# Altium project fastic_readout.PrjPcb (part 2 of 3)

## Sheet hv.SchDoc: FastIC+ readout
size 297 x 209 mm; Organization: CERN; SheetNumber: 5; SheetTotal: 6; Projet: Fast Timing; ModifiedDate: -
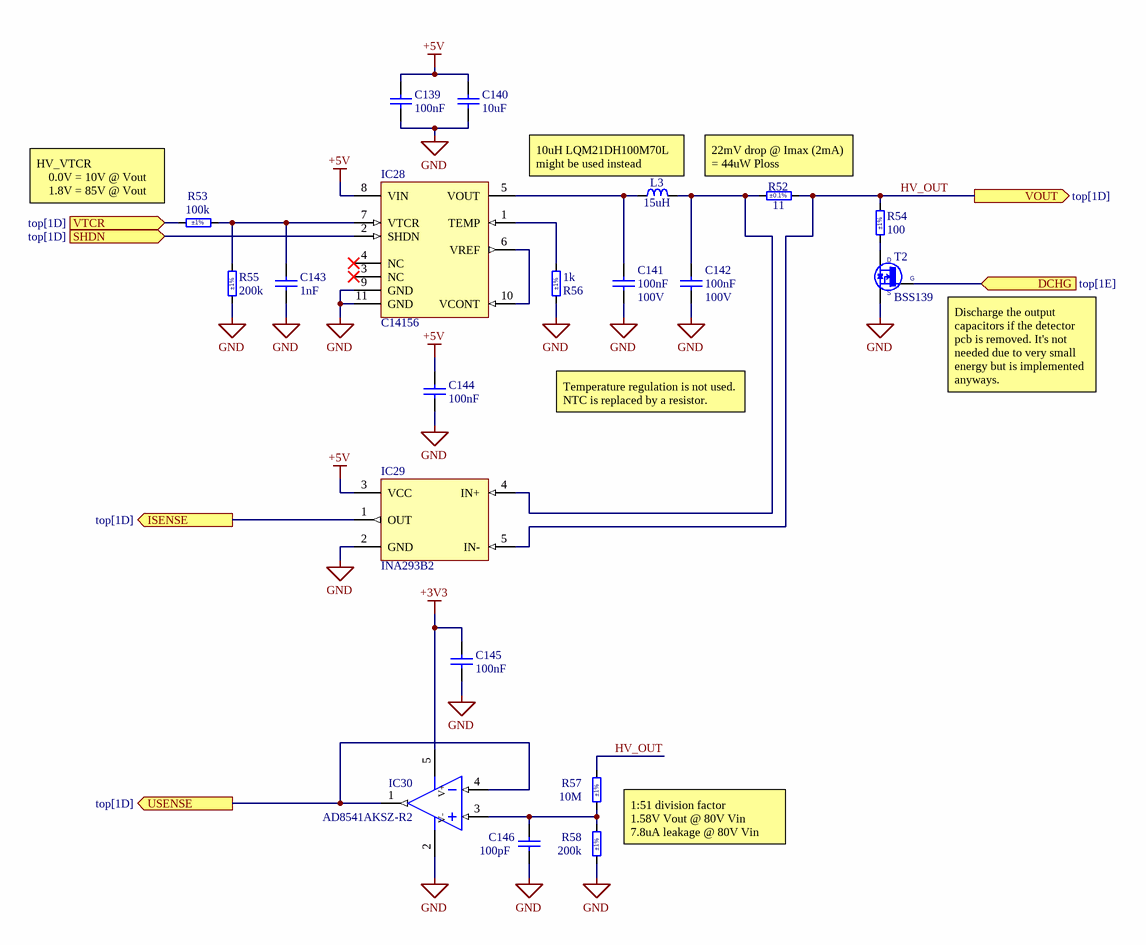
[diagram p2: hv.SchDoc]

### Parts
(Parts that share a designator on the sheet are numbered #1, #2 ... from top to bottom, then left to right.)
C139  100nF  [CAPC1005X55N]
C140  10uF  [CAPC1608X80N]
C141  100nF  Voltage: 100V  [CAPC1608X90N]
C142#1  100nF  Voltage: 100V  [CAPC1608X90N]
C143  1nF  [CAPC1005X55N]
C144  100nF  [CAPC1005X55N]
C145  100nF  [CAPC1005X55N]
C146  100pF  [CAPC1005X55N]
IC28  C14156  [C14156]  (no BOM)
IC29  INA293B2  [SOT95P280X145-5N]
IC30  AD8541AKSZ-R2  [SOT65P210X110-5N]
L3  15uH  [INDC2013X145N]
R52  11  Tolerance: ±0.1%  [RESC1608X55N]
R53  100k  Tolerance: ±1%  [RESC1005X40N]
R54  100  Tolerance: ±1%  [RESC1005X40N]
R55  200k  Tolerance: ±1%  [RESC1005X40N]
R56  1k  Tolerance: ±1%  [RESC1005X40N]
R57  10M  Tolerance: ±1%  [RESC1005X35N]
R58  200k  Tolerance: ±1%  [RESC1005X40N]
T2  BSS139  [SOT95P240X110-3N]

### Ports
DCHG (in, see top[1E]), ISENSE (out, see top[1D]), SHDN (in, see top[1D]), USENSE (out, see top[1D]), VOUT (out, see top[1D]), VTCR (in, see top[1D])

### Nets
+3V3: C145.2 IC30.5(V+)
+5V: C139.2 C140.1 C144.2 IC28.8(VIN) IC29.3(VCC)
GND: C139.1 C140.2 C141.1 C142#1.1 C143.2 C144.1 C145.1 C146.1 IC28.9(GND) IC28.11(GND) IC29.2(GND) IC30.2(V-) R55.1 R56.1 R58.1 T2.2(S)
HV_OUT: IC29.5(IN-) R52.2 R54.2 R57.2 ; port VOUT
NetC141_2: C141.2 IC28.5(VOUT) L3.1
NetC142#1_2: C142#1.2 IC29.4(IN+) L3.2 R52.1
NetC143_1: C143.1 IC28.7(VTCR) R53.2 R55.2
NetC146_2: C146.2 IC30.3(IN+) R57.1 R58.2
NetIC28_1: IC28.1(TEMP) R56.2
NetIC28_2: IC28.2(SHDN) ; port SHDN
NetIC28_6: IC28.6(VREF) IC28.10(VCONT)
NetIC29_1: IC29.1(OUT) ; port ISENSE
NetIC30_1: IC30.1(OUT) IC30.4(IN-) ; port USENSE
NetR53_1: R53.1 ; port VTCR
NetR54_1: R54.1 T2.3(D)
NetT2_1: T2.1(G) ; port DCHG

Not connected (* = marked no-connect by the designer): IC28 3(NC)* 4(NC)*

### Notes on the sheet
- (near R53) HV_VTCR
  0.0V = 10V @ Vout
  1.8V = 85V @ Vout
- (near L3) 10uH LQM21DH100M70L might be used instead
- (near R52) 22mV drop @ Imax (2mA)
  = 44uW Ploss
- (near T2) Discharge the output capacitors if the detector pcb is removed. It's not needed due to very small energy but is implemented anyways.
- Temperature regulation is not used. NTC is replaced by a resistor.
- 1:51 division factor
  1.58V Vout @ 80V Vin
  7.8uA leakage @ 80V Vin
- Project/Equipment
- Document
- Designer
- Drawn by
- Check.by
- File
- Last Mod.
- Print Date
- Sheet
- Size
- A4
- of
- Rev

### Library data of the parts
C139 C144 C145 = CC0402_100NF_16V_10%_X7R: Non-polarised capacitor; Part Description: SMD Multilayer Chip Ceramic Capacitor; Manufacturer: GENERIC; Manufacturer1 Part Number: GRM155R71C104KA88D; Voltage: 16V; TC: X7R; Tolerance: ±10%; Part Number: CC0402_100NF_16V_10%_X7R; Component Kind: Standard; Component Type: Standard; Pin Count: 2; Value: 100nF; Status: Not Recommended; Manufacturer Part Number: CC0402_100NF_16V_10%_X7R; Case: 0402; Mounted: Yes; Socket: No; SMD: Yes; Sense: No; Manufacturer1 Example: MURATA; Manufacturer1 ComponentHeight: 0.55mm; HelpURL: \\cern.ch\dfs\Applications\Altium\Datasheets\CC0402_X7R_MURATA_GRM.pdf; Author: CERN DEM JLC; CreateDate: 05/12/2013; LatestRevisionDate: 03/12/2007
C140 = CC0603_10UF_10V_10%_X5R: Non-polarised capacitor; Part Description: SMD Multilayer Chip Ceramic Capacitor; Manufacturer: GENERIC; Manufacturer1 Part Number: GRM188R61A106KE69D; Voltage: 10V; TC: X5R; Tolerance: ±10%; Part Number: CC0603_10UF_10V_10%_X5R; Component Kind: Standard; Component Type: Standard; Pin Count: 2; Value: 10uF; Status: None; Manufacturer Part Number: CC0603_10UF_10V_10%_X5R; Case: 0603; Mounted: Yes; Socket: No; SMD: Yes; Sense: No; Manufacturer1 Example: MURATA; Manufacturer1 ComponentHeight: 0.8mm; HelpURL: \\cern.ch\dfs\Applications\Altium\Datasheets\CC0603_MURATA_GRM188R61A106KE69D.pdf; Author: CERN DEM JLC; CreateDate: 31/01/2017; LatestRevisionDate: 31/01/2017
C141 C142#1 = CC0603_100NF_100V_10%_X7R: Non-polarised capacitor; Part Description: SMD Multilayer Chip Ceramic Capacitor; Manufacturer: GENERIC; Manufacturer1 Part Number: GRM188R72A104KA35D; TC: X7R; Tolerance: ±10%; Part Number: CC0603_100NF_100V_10%_X7R; Component Kind: Standard; Component Type: Standard; Pin Count: 2; Value: 100nF; Status: None; Manufacturer Part Number: CC0603_100NF_100V_10%_X7R; Case: 0603; Mounted: Yes; Socket: No; SMD: Yes; Sense: No; Manufacturer1 Example: MURATA; Manufacturer1 ComponentHeight: 0.9mm; HelpURL: \\cern.ch\dfs\Applications\Altium\Datasheets\CC0603_MURATA_GRM188R72A104KA35D.pdf; Author: CERN DEM JLC; CreateDate: 11/12/2013; LatestRevisionDate: 11/12/2013
C143 = CC0402_1NF_50V_10%_X7R: Non-polarised capacitor; Part Description: SMD Multilayer Chip Ceramic Capacitor; Manufacturer: GENERIC; Manufacturer1 Part Number: 223858715623; Voltage: 50V; TC: X7R; Tolerance: ±10%; Part Number: CC0402_1NF_50V_10%_X7R; Component Kind: Standard; Component Type: Standard; Pin Count: 2; Value: 1nF; Status: Not Recommended; Manufacturer Part Number: CC0402_1NF_50V_10%_X7R; Case: 0402; Mounted: Yes; Socket: No; SMD: Yes; Sense: No; Manufacturer1 Example: PHYCOMP; Manufacturer1 ComponentHeight: 0.55mm; HelpURL: \\cern.ch\dfs\Applications\Altium\Datasheets\CC0402_X7R_PHYCOMP.pdf; Author: CERN DEM JLC; CreateDate: 03/12/2007; LatestRevisionDate: 03/12/2007
C146 = CC0402_100PF_50V_5%_C0G: Non-polarised capacitor; Part Description: SMD Multilayer Chip Ceramic Capacitor; Manufacturer: GENERIC; Manufacturer1 Part Number: C0402C101J5GACTU; Voltage: 50V; TC: C0G/NP0; Tolerance: ±5%; Part Number: CC0402_100PF_50V_5%_C0G; Component Kind: Standard; Component Type: Standard; Pin Count: 2; Value: 100pF; Status: Preferred; Manufacturer Part Number: CC0402_100PF_50V_5%_C0G; Case: 0402; Mounted: Yes; Socket: No; SMD: Yes; Sense: No; Manufacturer1 Example: KEMET; Manufacturer1 ComponentHeight: 0.55mm; HelpURL: \\cern.ch\dfs\Applications\Altium\Datasheets\CC0402_C0G_KEMET_(Commercial Grade).pdf; Author: CERN DEM JLC; CreateDate: 12/3/2007; LatestRevisionDate: 4/22/2015
IC30 = AD8541AKSZ-R2: Operational Amplifier; Part Description: CMOS Rail-to-Rail General-Purpose Amplifier; Manufacturer: ANALOG DEVICES; PressFit: No; Bonding: No; Part Number: AD8541AKSZ-R2; Component Kind: Standard; Component Type: Standard; Device: AD8541AKSZ-R2; PackageDescription: SOT353, SC70-5, SOT, 0.65mm Pitch; 5 Pin, 1.25mm W X 2.00mm L X 1.10mm H body, IPC Medium Density; Manufacturer Part Number: AD8541AKS; Pin Count: 5; Case: SOT353; Mounted: Yes; Socket: No; SMD: Yes; Sense: No; ComponentHeight: 1.1mm; Author: CERN DEM JLC; HelpURL: \\cern.ch\dfs\Applications\Altium\Datasheets\AD8541AKSZ-R2.pdf; CreateDate: 4/25/2012; LatestRevisionDate: 3/29/2022
L3 = IND0805_TDK_MLZ2012M150WT000: Inductor; Part Description: SMD Multilayer Ferrite (MLZ Series); Manufacturer: TDK; Power: 100mA; Resistance: 0.95R; Tolerance: ±20%; Part Number: IND0805_TDK_MLZ2012M150WT000; Component Kind: Standard; Component Type: Standard; Pin Count: 2; Value: 15uH; Manufacturer Part Number: MLZ2012M150WT000; Case: 0805; Mounted: Yes; Socket: No; SMD: Yes; Sense: No; ComponentHeight: 1.45mm; HelpURL: \\cern.ch\dfs\Applications\Altium\Datasheets\IND0805_TDK_MLZ2012.pdf; Author: CERN DEM HF; CreateDate: 4/18/2024; LatestRevisionDate: 4/18/2024
R52 = R0603_11R_0.1%_0.063W_10PPM: Resistor - 0.1%; Part Description: Thin Film Chip Resistor; Manufacturer: GENERIC; Manufacturer1 Part Number: RN73C1J11RBTDF; Power: 0.063W; TC: ±10ppm; PressFit: No; Part Number: R0603_11R_0.1%_0.063W_10PPM; Component Kind: Standard; Component Type: Standard; Pin Count: 2; Value: 11; Status: Not Recommended; Manufacturer Part Number: R0603_11R_0.1%_0.063W_10PPM; Case: 0603; Mounted: Yes; Sense: No; Socket: No; SMD: Yes; Manufacturer1 Example: TYCO HOLSWORTHY; Manufacturer1 ComponentHeight: 0.5mm; HelpURL: \\cern.ch\dfs\Applications\Altium\Datasheets\R0603_Tyco_RN73.pdf; Author: CERN DEM JLC; CreateDate: 12/3/2007; LatestRevisionDate: 3/13/2008
R53 = R0402_100K_1%_0.0625W_100PPM: Resistor - 1%; Part Description: General Purpose Thick Film Chip Resistor; Manufacturer: GENERIC; Manufacturer1 Part Number: 232270671004L; TC: ±100ppm/°C; PressFit: No; Part Number: R0402_100K_1%_0.0625W_100PPM; Component Kind: Standard; Component Type: Standard; Pin Count: 2; Value: 100k; Status: Not Recommended; Power: 0.0625W; Manufacturer Part Number: R0402_100K_1%_0.0625W_100PPM; Case: 0402; Mounted: Yes; Sense: No; Socket: No; SMD: Yes; Manufacturer1 Example: YAGEO PHYCOMP; Manufacturer1 ComponentHeight: 0.4mm; HelpURL: \\cern.ch\dfs\Applications\Altium\Datasheets\R0402_Phycomp_RC0402.pdf; Author: CERN DEM JLC; CreateDate: 12/3/2007; LatestRevisionDate: 10/17/2012
R54 = R0402_100R_1%_0.0625W_100PPM: Resistor - 1%; Part Description: General Purpose Thick Film Chip Resistor; Manufacturer: GENERIC; Manufacturer1 Part Number: 232270671001L; TC: ±100ppm/°C; PressFit: No; Part Number: R0402_100R_1%_0.0625W_100PPM; Component Kind: Standard; Component Type: Standard; Pin Count: 2; Value: 100; Status: Not Recommended; Power: 0.0625W; Manufacturer Part Number: R0402_100R_1%_0.0625W_100PPM; Case: 0402; Mounted: Yes; Sense: No; Socket: No; SMD: Yes; Manufacturer1 Example: YAGEO PHYCOMP; Manufacturer1 ComponentHeight: 0.4mm; HelpURL: \\cern.ch\dfs\Applications\Altium\Datasheets\R0402_Phycomp_RC0402.pdf; Author: CERN DEM JLC; CreateDate: 12/3/2007; LatestRevisionDate: 10/17/2012
R55 R58 = R0402_200K_1%_0.0625W_100PPM: Resistor - 1%; Part Description: General Purpose Thick Film Chip Resistor; Manufacturer: GENERIC; Manufacturer1 Part Number: 232270672004L; TC: ±100ppm/°C; PressFit: No; Part Number: R0402_200K_1%_0.0625W_100PPM; Component Kind: Standard; Component Type: Standard; Pin Count: 2; Value: 200k; Status: Not Recommended; Power: 0.0625W; Manufacturer Part Number: R0402_200K_1%_0.0625W_100PPM; Case: 0402; Mounted: Yes; Sense: No; Socket: No; SMD: Yes; Manufacturer1 Example: YAGEO PHYCOMP; Manufacturer1 ComponentHeight: 0.4mm; HelpURL: \\cern.ch\dfs\Applications\Altium\Datasheets\R0402_Phycomp_RC0402.pdf; Author: CERN DEM JLC; CreateDate: 12/3/2007; LatestRevisionDate: 10/17/2012
R56 = R0402_1K_1%_0.0625W_100PPM: Resistor - 1%; Part Description: General Purpose Thick Film Chip Resistor; Manufacturer: GENERIC; Manufacturer1 Part Number: 232270671002L; TC: ±100ppm/°C; PressFit: No; Part Number: R0402_1K_1%_0.0625W_100PPM; Component Kind: Standard; Component Type: Standard; Pin Count: 2; Value: 1k; Status: Not Recommended; Power: 0.0625W; Manufacturer Part Number: R0402_1K_1%_0.0625W_100PPM; Case: 0402; Mounted: Yes; Sense: No; Socket: No; SMD: Yes; Manufacturer1 Example: YAGEO PHYCOMP; Manufacturer1 ComponentHeight: 0.4mm; HelpURL: \\cern.ch\dfs\Applications\Altium\Datasheets\R0402_Phycomp_RC0402.pdf; Author: CERN DEM JLC; CreateDate: 12/3/2007; LatestRevisionDate: 10/17/2012
R57 = R0402_100K_0.1%_0.063W_25PPM: Resistor - 1%; Part Description: Thin Film Precision Resistor; Manufacturer: GENERIC; Manufacturer1 Part Number: CPF0402B100KE1; Value: 100k; Power: 0.063W; TC: ±25ppm/°C; PressFit: No; Part Number: R0402_100K_0.1%_0.063W_25PPM; Component Kind: Standard; Component Type: Standard; Pin Count: 2; Status: Not Recommended; Manufacturer Part Number: R0402_100K_0.1%_0.063W_25PPM; Case: 0402; Mounted: Yes; Sense: No; Socket: No; SMD: Yes; Manufacturer1 Example: TE CONNECTIVITY; Manufacturer1 ComponentHeight: 0.35mm; HelpURL: \\cern.ch\dfs\Applications\Altium\Datasheets\R0402_TYCO_CPF.pdf; Author: CERN DEM JMW; CreateDate: 9/22/2015; LatestRevisionDate: 9/22/2015
T2 = BSS139: N-CHANNEL MOSFET WITH DIODE; Part Description: 250V, 30mA N-Channel  SIPMOS® Small-Signal-Transistor; Manufacturer: INFINEON; PressFit: No; Bonding: No; Part Number: BSS139; Component Kind: Standard; Component Type: Standard; Device: BSS139; PackageDescription: SOT23, 0.95mm Pitch; 3 Pin, 1.40mm W X 3.00mm L X 1.10mm H body, IPC Medium Density; Manufacturer Part Number: BSS139; Pin Count: 3; Case: SOT23-3; Mounted: Yes; Socket: No; SMD: Yes; Sense: No; ComponentHeight: 1.1mm; HelpURL: \\cern.ch\dfs\Applications\Altium\Datasheets\BSS139.pdf; Author: CERN DEM JLC; CreateDate: 9/23/2014; LatestRevisionDate: 9/23/2014

## Sheet clock.SchDoc: FastIC+ readout
size 297 x 209 mm; Organization: CERN; SheetNumber: 3; SheetTotal: 6; Projet: Fast Timing; ModifiedDate: -
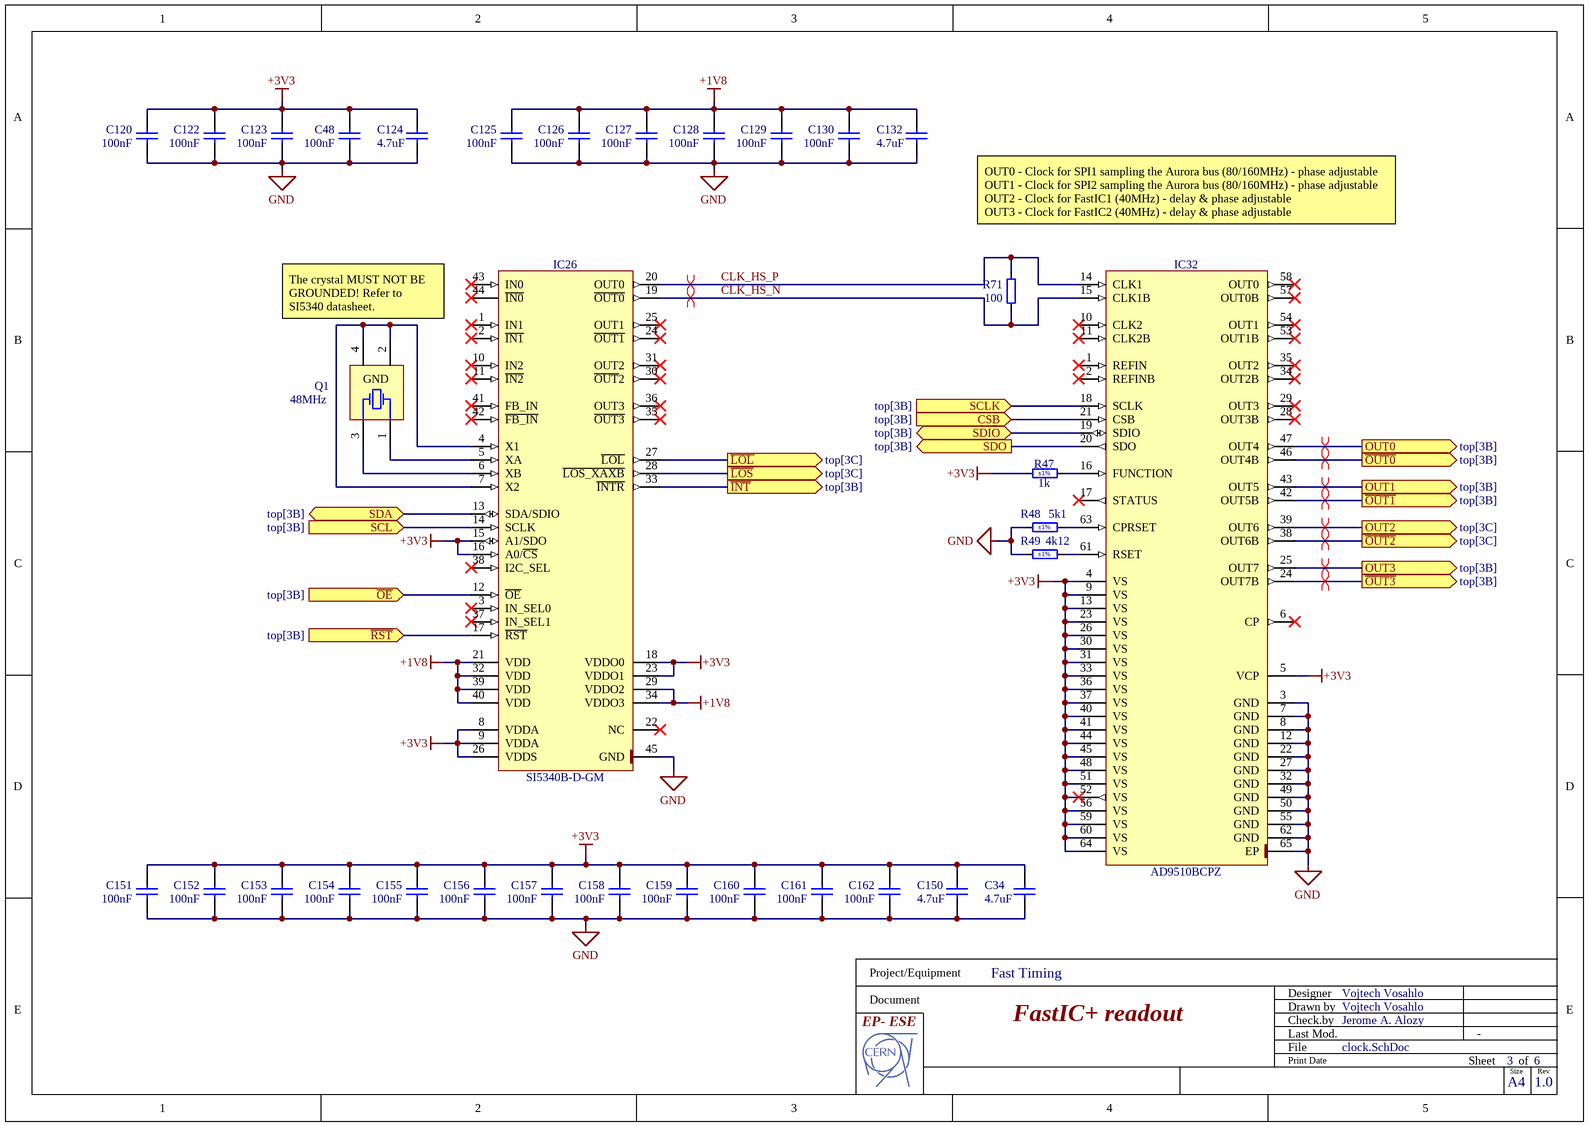
[diagram p3: clock.SchDoc]

### Parts
(Parts that share a designator on the sheet are numbered #1, #2 ... from top to bottom, then left to right.)
C34#1  4.7uF  [CAPC1608X87N]
C48  100nF  [CAPC1005X55N]
C120#1  100nF  [CAPC1005X55N]
C122#1  100nF  [CAPC1005X55N]
C123  100nF  [CAPC1005X55N]
C124#1  4.7uF  [CAPC1608X87N]
C125  100nF  [CAPC1005X55N]
C126#1  100nF  [CAPC1005X55N]
C127#1  100nF  [CAPC1005X55N]
C128#1  100nF  [CAPC1005X55N]
C129#1  100nF  [CAPC1005X55N]
C130#1  100nF  [CAPC1005X55N]
C132#1  4.7uF  [CAPC1608X87N]
C150  4.7uF  [CAPC1608X87N]
C151  100nF  [CAPC1005X55N]
C152  100nF  [CAPC1005X55N]
C153  100nF  [CAPC1005X55N]
C154  100nF  [CAPC1005X55N]
C155  100nF  [CAPC1005X55N]
C156  100nF  [CAPC1005X55N]
C157  100nF  [CAPC1005X55N]
C158  100nF  [CAPC1005X55N]
C159  100nF  [CAPC1005X55N]
C160  100nF  [CAPC1005X55N]
C161  100nF  [CAPC1005X55N]
C162  100nF  [CAPC1005X55N]
IC26  SI5340B-D-GM  [QFN50P700X700X90-45N-S530]
IC32  AD9510BCPZ  [QFN50P900X900X100-65N-S485]
Q1  48MHz  [XTAL_KYOCERA_CX3225SB]
R47#1  1k  Tolerance: ±1%  [RESC1005X40N]
R48#1  5k1  Tolerance: ±1%  [RESC1005X40N]
R49#1  4k12  Tolerance: ±1%  [RESC1005X40N]
R71  100  [RESC1005X40N]

### Ports
CSB (in, see top[3B]), OUT0 (out, see top[3B]), OUT1 (out, see top[3B]), OUT2 (out, see top[3C]), OUT3 (out, see top[3B]), SCL (in, see top[3B]), SCLK (in, see top[3B]), SDA (bidir, see top[3B]), SDIO (bidir, see top[3B]), SDO (out, see top[3B]), ~{INT} (out, see top[3B]), ~{LOL} (out, see top[3C]), ~{LOS} (out, see top[3C]), ~{OE} (in, see top[3B]), ~{OUT0} (out, see top[3B]), ~{OUT1} (out, see top[3B]), ~{OUT2} (out, see top[3C]), ~{OUT3} (out, see top[3B]), ~{RST} (in, see top[3B])

### Nets
+1V8: C125.2 C126#1.2 C127#1.2 C128#1.2 C129#1.2 C130#1.2 C132#1.1 IC26.21(VDD) IC26.29(VDDO2) IC26.32(VDD) IC26.34(VDDO3) IC26.39(VDD) IC26.40(VDD)
+3V3: C34#1.1 C48.2 C120#1.2 C122#1.2 C123.2 C124#1.1 C150.1 C151.2 C152.2 C153.2 C154.2 C155.2 C156.2 C157.2 C158.2 C159.2 C160.2 C161.2 C162.2 IC26.8(VDDA) IC26.9(VDDA) IC26.15(A1/SDO) IC26.16(A0/~{CS}) IC26.18(VDDO0) IC26.23(VDDO1) IC26.26(VDDS) IC32.4(VS) IC32.5(VCP) IC32.9(VS) IC32.13(VS) IC32.23(VS) IC32.26(VS) IC32.30(VS) IC32.31(VS) IC32.33(VS) IC32.36(VS) IC32.37(VS) IC32.40(VS) IC32.41(VS) IC32.44(VS) IC32.45(VS) IC32.48(VS) IC32.51(VS) IC32.52(VS) IC32.56(VS) IC32.59(VS) IC32.60(VS) IC32.64(VS) R47#1.1
GND: C34#1.2 C48.1 C120#1.1 C122#1.1 C123.1 C124#1.2 C125.1 C126#1.1 C127#1.1 C128#1.1 C129#1.1 C130#1.1 C132#1.2 C150.2 C151.1 C152.1 C153.1 C154.1 C155.1 C156.1 C157.1 C158.1 C159.1 C160.1 C161.1 C162.1 IC26.45(GND) IC32.3(GND) IC32.7(GND) IC32.8(GND) IC32.12(GND) IC32.22(GND) IC32.27(GND) IC32.32(GND) IC32.49(GND) IC32.50(GND) IC32.55(GND) IC32.62(GND) IC32.65(EP) R48#1.1 R49#1.1
CLK_HS_N: IC26.19(~{OUT0}) IC32.15(CLK1B) R71.2
CLK_HS_P: IC26.20(OUT0) IC32.14(CLK1) R71.1
NetIC26_4: IC26.4(X1) IC26.7(X2) Q1.2(GND) Q1.4(GND)
NetIC26_5: IC26.5(XA) Q1.1(X)
NetIC26_6: IC26.6(XB) Q1.3(X)
NetIC26_12: IC26.12(~{OE}) ; port ~{OE}
NetIC26_13: IC26.13(SDA/SDIO) ; port SDA
NetIC26_14: IC26.14(SCLK) ; port SCL
NetIC26_17: IC26.17(~{RST}) ; port ~{RST}
NetIC26_27: IC26.27(~{LOL}) ; port ~{LOL}
NetIC26_28: IC26.28(~{LOS_XAXB}) ; port ~{LOS}
NetIC26_33: IC26.33(~{INTR}) ; port ~{INT}
NetIC32_16: IC32.16(FUNCTION) R47#1.2
NetIC32_18: IC32.18(SCLK) ; port SCLK
NetIC32_19: IC32.19(SDIO) ; port SDIO
NetIC32_20: IC32.20(SDO) ; port SDO
NetIC32_21: IC32.21(CSB) ; port CSB
NetIC32_24: IC32.24(OUT7B) ; port ~{OUT3}
NetIC32_25: IC32.25(OUT7) ; port OUT3
NetIC32_38: IC32.38(OUT6B) ; port ~{OUT2}
NetIC32_39: IC32.39(OUT6) ; port OUT2
NetIC32_42: IC32.42(OUT5B) ; port ~{OUT1}
NetIC32_43: IC32.43(OUT5) ; port OUT1
NetIC32_46: IC32.46(OUT4B) ; port ~{OUT0}
NetIC32_47: IC32.47(OUT4) ; port OUT0
NetIC32_61: IC32.61(RSET) R49#1.2
NetIC32_63: IC32.63(CPRSET) R48#1.2

Not connected (* = marked no-connect by the designer): IC26 1(IN1)* 2(~{IN1})* 3(IN_SEL0)* 10(IN2)* 11(~{IN2})* 22(NC)* 24(~{OUT1})* 25(OUT1)* 30(~{OUT}2)* 31(OUT2)* 35(~{OUT3})* 36(OUT3)* 37(IN_SEL1)* 38(I2C_SEL)* 41(FB_IN)* 42(~{FB_IN})* 43(IN0)* 44(~{IN0})*; IC32 1(REFIN)* 2(REFINB)* 6(CP)* 10(CLK2)* 11(CLK2B)* 17(STATUS)* 28(OUT3B)* 29(OUT3)* 34(OUT2B)* 35(OUT2)* 53(OUT1B)* 54(OUT1)* 57(OUT0B)* 58(OUT0)*

### Layout directives
differential pair: CLK_HS_N, CLK_HS_P, NetIC32_24, NetIC32_25, NetIC32_38, NetIC32_39, NetIC32_42, NetIC32_43, NetIC32_46, NetIC32_47

### Notes on the sheet
- OUT0 - Clock for SPI1 sampling the Aurora bus (80/160MHz) - phase adjustable
  OUT1 - Clock for SPI2 sampling the Aurora bus (80/160MHz) - phase adjustable
  OUT2 - Clock for FastIC1 (40MHz) - delay & phase adjustable
  OUT3 - Clock for FastIC2 (40MHz) - delay & phase adjustable
- The crystal MUST NOT BE GROUNDED! Refer to SI5340 datasheet.
- Project/Equipment
- Document
- Designer
- Drawn by
- Check.by
- File
- Last Mod.
- Print Date
- Sheet
- Size
- A4
- of
- Rev

### Library data of the parts
C34#1 C124#1 C132#1 C150 = CC0603_4.7UF_6.3V_10%_X5R: Non-polarised capacitor; Part Description: SMD Multilayer Chip Ceramic Capacitor; Manufacturer: GENERIC; Manufacturer1 Part Number: 225520613672; Voltage: 6.3V; TC: X5R; Tolerance: ±10%; Part Number: CC0603_4.7UF_6.3V_10%_X5R; Component Kind: Standard; Component Type: Standard; Pin Count: 2; Value: 4.7uF; Status: Preferred; Manufacturer Part Number: CC0603_4.7UF_6.3V_10%_X5R; Case: 0603; Mounted: Yes; Socket: No; SMD: Yes; Sense: No; Manufacturer1 Example: PHYCOMP; Manufacturer1 ComponentHeight: 0.87mm; HelpURL: \\cern.ch\dfs\Applications\Altium\Datasheets\CC0805_X5R_PHYCOMP_HC.pdf; Author: CERN DEM JLC; CreateDate: 03/12/2007; LatestRevisionDate: 03/12/2007
C48 C120#1 C122#1 C123 C125 C126#1 C127#1 C128#1 C129#1 C130#1 C151-C162 = CC0402_100NF_16V_10%_X7R: as C139 on sheet hv; Part Number: CC0402_100NF_16V_10%_X7R; Component Kind: Standard; Component Type: Standard; Pin Count: 2; Value: 100nF; Status: Not Recommended; Manufacturer Part Number: CC0402_100NF_16V_10%_X7R; Case: 0402; Mounted: Yes; Socket: No; SMD: Yes; Sense: No; Manufacturer1 Example: MURATA; Manufacturer1 ComponentHeight: 0.55mm; HelpURL: \\cern.ch\dfs\Applications\Altium\Datasheets\CC0402_X7R_MURATA_GRM.pdf; Author: CERN DEM JLC; CreateDate: 05/12/2013; LatestRevisionDate: 03/12/2007
IC26 = SI5340B-D-GM: Low-Jitter, 4-Output, Any-Frequency, Any-Output Clock Generator; Manufacturer: SILICON LABS; PressFit: No; Bonding: No; Part Number: SI5340B-D-GM; Component Kind: Standard; Component Type: Standard; Device: SI5340B-D-GM; PackageDescription: QFN, 0.50mm Pitch, Square; 44 Pin, 7.00mm L X 7.00mm W X 0.90mm H body (w/Thermal Tab 5.30 X 5.30mm), IPC Medium Density; Part Description: Low-Jitter, 4-Output, Any-Frequency, Any-Output Clock Generator; Manufacturer Part Number: SI5340B-D-GM; Pin Count: 45; Case: QFN44; Mounted: Yes; Socket: No; SMD: Yes; Sense: No; ComponentHeight: 0.9mm; Author: CERN DEM JLC; HelpURL: \\cern.ch\dfs\Applications\Altium\Datasheets\SI5340B-D-GM.pdf; CreateDate: 12/14/2017; LatestRevisionDate: 12/14/2017
IC32 = AD9510BCPZ: 1.2 GHz Clock Distribution IC, PLL Core, Dividers, Delay Adjust, Eight Outputs; Manufacturer: ANALOG DEVICES; PressFit: No; Bonding: No; Part Number: AD9510BCPZ; Component Kind: Standard; Component Type: Standard; Device: AD9510BCPZ; PackageDescription: QFN, 0.50mm Pitch, Square; 64 Pin, 9.00mm L X 9.00mm W X 1.00mm H body (w/Thermal Tab 4.85 X 4.85mm), IPC Medium Density; Part Description: 1.2 GHz Clock Distribution IC, PLL Core, Dividers, Delay Adjust, Eight Outputs; Manufacturer Part Number: AD9510BCP; Pin Count: 65; Case: QFN64; Mounted: Yes; Socket: No; SMD: Yes; Sense: No; ComponentHeight: 1mm; HelpURL: \\cern.ch\dfs\Applications\Altium\Datasheets\AD9510BCPZ.pdf; Author: CERN DEM JLC; CreateDate: 10/9/2012; LatestRevisionDate: 3/29/2022
Q1 = XTAL_48MHZ_KYOCERA_CX3225SB48000D0FPJC1: Crystal 4 pins 1=XTAL Control 2=GND3=XTAL 4=GND; Part Description: Tolerance: ±10ppm, Stability: ±15ppm, 8pF, -40°C to +85°C, Surface Mount Crystal; PressFit: No; Bonding: No; Part Number: XTAL_48MHZ_KYOCERA_CX3225SB48000D0FPJC1; Component Kind: Standard; Component Type: Standard; PackageDescription: SMD Crystal Kyocera, 4 Pins, 2.50mm L X 3.20mm W X 0.6mm H; Value: 48MHz; Manufacturer: KYOCERA; Manufacturer Part Number: CX3225SB48000D0FPJC1; Pin Count: 4; Mounted: Yes; Socket: No; SMD: Yes; Sense: No; ComponentHeight: 0.6mm; HelpURL: \\cern.ch\dfs\Applications\Altium\Datasheets\XTAL_KYOCERA_CX3225SB.pdf; Author: CERN DEM JLC; CreateDate: 6/5/2018; LatestRevisionDate: 6/5/2018
R47#1 = R0402_1K_1%_0.0625W_100PPM: as R56 on sheet hv; Part Number: R0402_1K_1%_0.0625W_100PPM; Component Kind: Standard; Component Type: Standard; Pin Count: 2; Value: 1k; Status: Not Recommended; Power: 0.0625W; Manufacturer Part Number: R0402_1K_1%_0.0625W_100PPM; Case: 0402; Mounted: Yes; Sense: No; Socket: No; SMD: Yes; Manufacturer1 Example: YAGEO PHYCOMP; Manufacturer1 ComponentHeight: 0.4mm; HelpURL: \\cern.ch\dfs\Applications\Altium\Datasheets\R0402_Phycomp_RC0402.pdf; Author: CERN DEM JLC; CreateDate: 12/3/2007; LatestRevisionDate: 10/17/2012
R48#1 = R0402_5K1_1%_0.0625W_100PPM: Resistor - 1%; Part Description: General Purpose Thick Film Chip Resistor; Manufacturer: GENERIC; Manufacturer1 Part Number: 232270675102L; TC: ±100ppm/°C; PressFit: No; Part Number: R0402_5K1_1%_0.0625W_100PPM; Component Kind: Standard; Component Type: Standard; Pin Count: 2; Value: 5k1; Status: Not Recommended; Power: 0.0625W; Manufacturer Part Number: R0402_5K1_1%_0.0625W_100PPM; Case: 0402; Mounted: Yes; Sense: No; Socket: No; SMD: Yes; Manufacturer1 Example: YAGEO PHYCOMP; Manufacturer1 ComponentHeight: 0.4mm; HelpURL: \\cern.ch\dfs\Applications\Altium\Datasheets\R0402_Phycomp_RC0402.pdf; Author: CERN DEM JLC; CreateDate: 12/3/2007; LatestRevisionDate: 10/17/2012
R49#1 = R0402_4K12_1%_0.0625W_100PPM: Resistor - 1%; Part Description: General Purpose Thick Film Chip Resistor; Manufacturer: GENERIC; Manufacturer1 Part Number: 232270674122L or RC0402FR-074K12L; TC: ±100ppm/°C; PressFit: No; Part Number: R0402_4K12_1%_0.0625W_100PPM; Component Kind: Standard; Component Type: Standard; Pin Count: 2; Value: 4k12; Status: Not Recommended; Power: 0.0625W; Manufacturer Part Number: R0402_4K12_1%_0.0625W_100PPM; Case: 0402; Mounted: Yes; Sense: No; Socket: No; SMD: Yes; Manufacturer1 Example: YAGEO PHYCOMP; Manufacturer1 ComponentHeight: 0.4mm; HelpURL: \\cern.ch\dfs\Applications\Altium\Datasheets\R0402_Phycomp_RC0402.pdf; Author: CERN DEM JLC; CreateDate: 10/24/2012; LatestRevisionDate: 10/24/2012
R71 = R0402_100R_1%_0.1W_100PPM: Resistor - 1%; Part Description: General Purpose Thick Film Chip Resistor; Manufacturer: GENERIC; Manufacturer Part Number: R0402_100R_1%_0.1W_100PPM_50V; Manufacturer1 Part Number: ERJ2RKF1000X; Power: 0.1W; TC: ±100ppm/°C; PressFit: No; Voltage: 50V; Part Number: R0402_100R_1%_0.1W_100PPM; Component Kind: Standard; Component Type: Standard; Pin Count: 2; Value: 100; Status: Not Recommended; Tolerance: ±1%; Case: 0402; Mounted: Yes; Sense: No; Socket: No; SMD: Yes; Manufacturer1 Example: PANASONIC; Manufacturer1 ComponentHeight: 0.4mm; HelpURL: \\cern.ch\dfs\Applications\Altium\Datasheets\R0402_PANASONIC_ERJ2RK.pdf; Author: CERN DEM JLC; CreateDate: 12/12/2013; LatestRevisionDate: 03/03/2015

## Sheet power.SchDoc: FastIC+ readout
size 420 x 297 mm; CheckedBy: Jerome A. Alozy; CompanyName: CERN; DrawnBy: Vojtech Vosahlo; Organization: CERN; Address1: European Organization for Nuclear Research; Address2: CH-1211 Genève 23 - Switzerland; Revision: 2.0; SheetNumber: 6; SheetTotal: 6; Projet: Fast Timing; CreateDate: 11/1/2024; DivGrp: EP-ESE; Designer: Vojtech Vosahlo; ModifiedDate: -
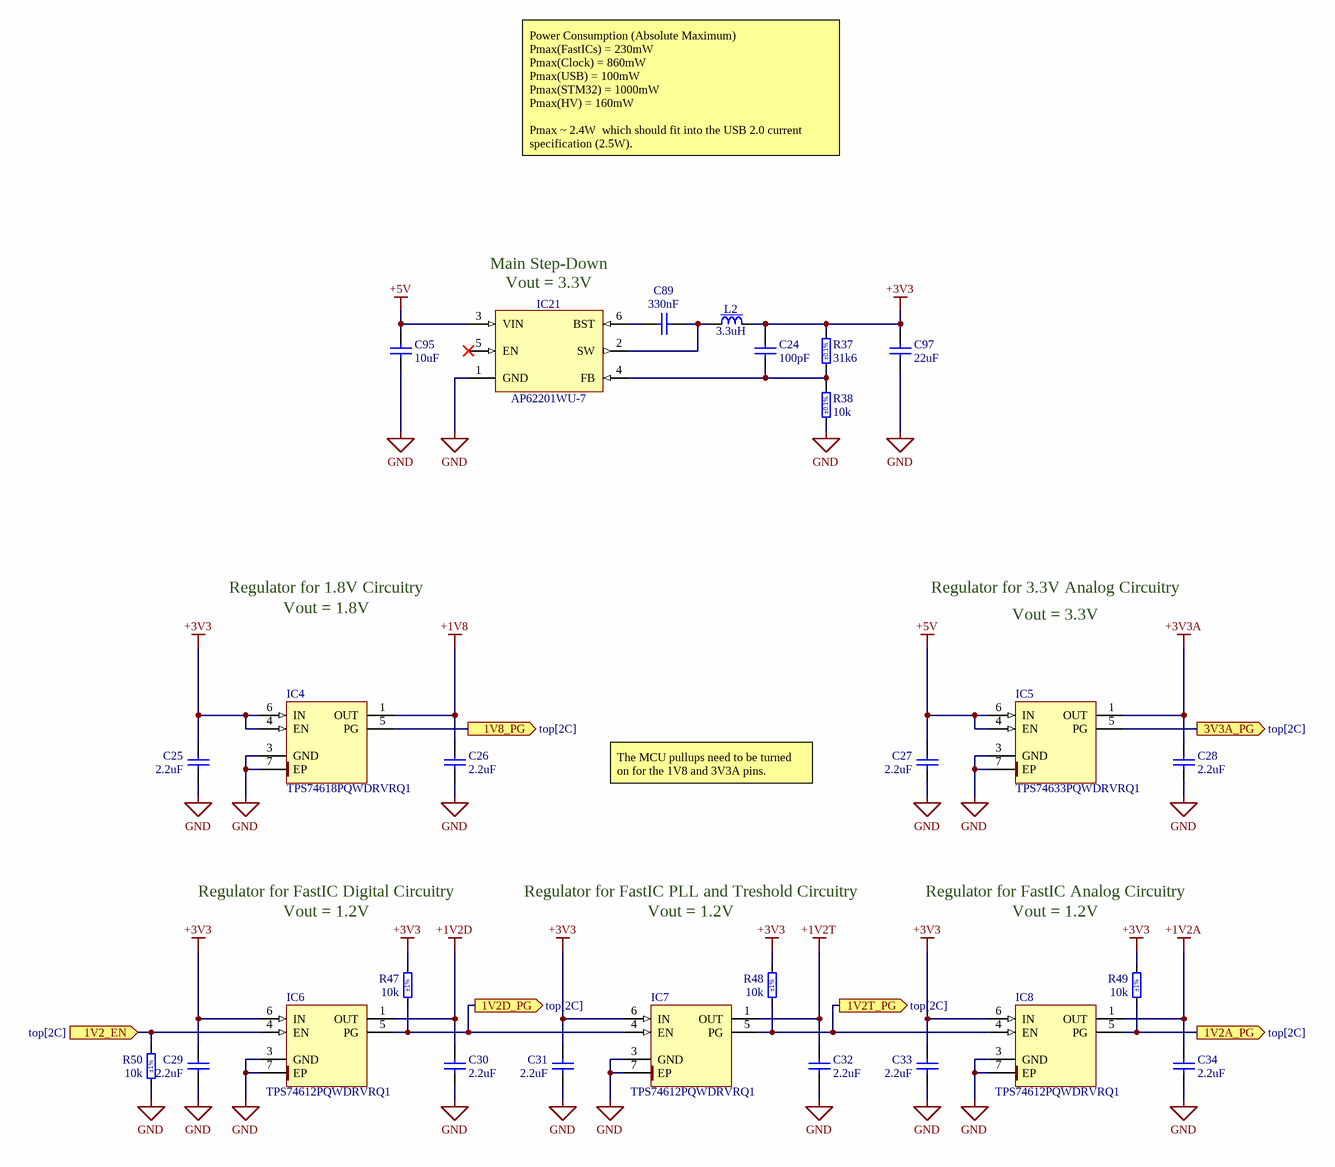
[diagram p4: power.SchDoc]

### Parts
(Parts that share a designator on the sheet are numbered #1, #2 ... from top to bottom, then left to right.)
C24  100pF  [CAPC1005X55N]
C25  2.2uF  [CAPC1608X90N]
C26  2.2uF  [CAPC1608X90N]
C27  2.2uF  [CAPC1608X90N]
C28  2.2uF  [CAPC1608X90N]
C29  2.2uF  [CAPC1608X90N]
C30#1  2.2uF  [CAPC1608X90N]
C31#1  2.2uF  [CAPC1608X90N]
C32#1  2.2uF  [CAPC1608X90N]
C33#1  2.2uF  [CAPC1608X90N]
C34#2  2.2uF  [CAPC1608X90N]
C89  330nF  [CAPC1005X55N]
C95  10uF  [CAPC2012X145N]
C97  22uF  [CAPC2013X145N]
IC4  TPS74618PQWDRVRQ1  [SON65P200X200X80-7N-R110X170]
IC5  TPS74633PQWDRVRQ1  [SON65P200X200X80-7N-R110X170]
IC6  TPS74612PQWDRVRQ1  [SON65P200X200X80-7N-R110X170]
IC7  TPS74612PQWDRVRQ1  [SON65P200X200X80-7N-R110X170]
IC8  TPS74612PQWDRVRQ1  [SON65P200X200X80-7N-R110X170]
IC21  AP62201WU-7  [SOT95P2d80X100-6N]
L2  3.3uH  [IND_COILCRAFT_XAL4030]
R37  31k6  Tolerance: ±0.1%  [RESC1005X35N]
R38  10k  Tolerance: ±0.1%  [RESC1005X35N]
R47#2  10k  Tolerance: ±1%  [RESC1005X40N]
R48#2  10k  Tolerance: ±1%  [RESC1005X40N]
R49#2  10k  Tolerance: ±1%  [RESC1005X40N]
R50  10k  Tolerance: ±1%  [RESC1005X40N]

### Ports
1V2_EN (in, see top[2C]), 1V2A_PG (out, see top[2C]), 1V2D_PG (out, see top[2C]), 1V2T_PG (out, see top[2C]), 1V8_PG (out, see top[2C]), 3V3A_PG (out, see top[2C])

### Nets
+1V2A: C34#2.2 IC8.1(OUT)
+1V2D: C30#1.2 IC6.1(OUT)
+1V2T: C32#1.2 IC7.1(OUT)
+1V8: C26.2 IC4.1(OUT)
+3V3: C24.2 C25.2 C29.2 C31#1.2 C33#1.2 C97.2 IC4.4(EN) IC4.6(IN) IC6.6(IN) IC7.6(IN) IC8.6(IN) L2.2 R37.2 R47#2.2 R48#2.2 R49#2.2
+3V3A: C28.2 IC5.1(OUT)
+5V: C27.2 C95.2 IC5.4(EN) IC5.6(IN) IC21.3(VIN)
GND: C25.1 C26.1 C27.1 C28.1 C29.1 C30#1.1 C31#1.1 C32#1.1 C33#1.1 C34#2.1 C95.1 C97.1 IC4.3(GND) IC4.7(EP) IC5.3(GND) IC5.7(EP) IC6.3(GND) IC6.7(EP) IC7.3(GND) IC7.7(EP) IC8.3(GND) IC8.7(EP) IC21.1(GND) R38.1 R50.1
NetC24_1: C24.1 IC21.4(FB) R37.1 R38.2
NetC89_1: C89.1 IC21.6(BST)
NetC89_2: C89.2 IC21.2(SW) L2.1
NetIC4_5: IC4.5(PG) ; port 1V8_PG
NetIC5_5: IC5.5(PG) ; port 3V3A_PG
NetIC6_4: IC6.4(EN) R50.2 ; port 1V2_EN
NetIC6_5: IC6.5(PG) IC7.4(EN) R47#2.1 ; port 1V2D_PG
NetIC7_5: IC7.5(PG) IC8.4(EN) R48#2.1 ; port 1V2T_PG
NetIC8_5: IC8.5(PG) R49#2.1 ; port 1V2A_PG

Not connected (* = marked no-connect by the designer): IC21 5(EN)*

### Notes on the sheet
- Power Consumption (Absolute Maximum)
  Pmax(FastICs) = 230mW
  Pmax(Clock) = 860mW
  Pmax(USB) = 100mW
  Pmax(STM32) = 1000mW
  Pmax(HV) = 160mW
  Pmax ~ 2.4W  which should fit into the USB 2.0 current specification (2.5W).
- Main Step-Down
- (near IC21) Vout = 3.3V
- Regulator for 1.8V Circuitry
- Regulator for 3.3V Analog Circuitry
- Vout = 1.8V
- Vout = 3.3V
- The MCU pullups need to be turned on for the 1V8 and 3V3A pins.
- Regulator for FastIC Digital Circuitry
- Vout = 1.2V
- Regulator for FastIC PLL and Treshold Circuitry
- Regulator for FastIC Analog Circuitry
- Project/Equipment
- Document
- Designer
- Drawn by
- Check.by
- File
- Last Mod.
- Print Date
- Sheet
- Size
- A3
- of
- Rev

### Library data of the parts
C24 = CC0402_100PF_50V_5%_C0G: as C146 on sheet hv; Part Number: CC0402_100PF_50V_5%_C0G; Component Kind: Standard; Component Type: Standard; Pin Count: 2; Value: 100pF; Status: Preferred; Manufacturer Part Number: CC0402_100PF_50V_5%_C0G; Case: 0402; Mounted: Yes; Socket: No; SMD: Yes; Sense: No; Manufacturer1 Example: KEMET; Manufacturer1 ComponentHeight: 0.55mm; HelpURL: \\cern.ch\dfs\Applications\Altium\Datasheets\CC0402_C0G_KEMET_(Commercial Grade).pdf; Author: CERN DEM JLC; CreateDate: 12/3/2007; LatestRevisionDate: 4/22/2015
C25-C29 C30#1 C31#1 C32#1 C33#1 C34#2 = CC0603_2.2UF_10V_20%_X7R: Non-polarised capacitor; Part Description: SMD Multilayer Chip Ceramic Capacitor; Manufacturer: GENERIC; Manufacturer1 Part Number: LMK107B7225MA-T; Voltage: 10V; TC: X7R; Tolerance: ±20%; Part Number: CC0603_2.2UF_10V_20%_X7R; Component Kind: Standard; Component Type: Standard; Pin Count: 2; Value: 2.2uF; Status: Not Recommended; Manufacturer Part Number: CC0603_2.2UF_10V_20%_X7R; Case: 0603; Mounted: Yes; Socket: No; SMD: Yes; Sense: No; Manufacturer1 Example: TAIYO YUDEN; Manufacturer1 ComponentHeight: 0.9mm; HelpURL: \\cern.ch\dfs\Applications\Altium\Datasheets\CC0603_X7R_TAIYO-YUDEN_HIGH-VALUE.pdf; Author: CERN DEM JLC; CreateDate: 6/22/2011; LatestRevisionDate: 6/27/2011
C89 = CC0402_330NF_35V_20%_X5R: Non-polarised capacitor; Part Description: SMD Multilayer Chip Ceramic Capacitor; Manufacturer: GENERIC; Manufacturer1 Part Number: C1005X5R1V334M050; Voltage: 35V; TC: X5R; Tolerance: ±20%; Part Number: CC0402_330NF_35V_20%_X5R; Component Kind: Standard; Component Type: Standard; Pin Count: 2; Value: 330nF; Status: Preferred; Manufacturer Part Number: CC0402_330NF_35V_20%_X5R; Case: 0402; Mounted: Yes; Socket: No; SMD: Yes; Sense: No; Manufacturer1 Example: TDK; Manufacturer1 ComponentHeight: 0.55mm; HelpURL: \\cern.ch\dfs\Applications\Altium\Datasheets\CC0402_X5R_TDK_C.pdf; Author: CERN DEM MR; CreateDate: 9/13/2016; LatestRevisionDate: 9/13/2016
C95 = CC0805_10UF_35V_10%_X5R_MURATA_GRM21BR6YA106KE43L: Non-polarised capacitor; Part Description: Chip Multilayer Ceramic Capacitor for General Purpose; Manufacturer: MURATA; Voltage: 35V; TC: X5R; Tolerance: ±10%; Part Number: CC0805_10UF_35V_10%_X5R_MURATA_GRM21BR6YA106KE43L; Component Kind: Standard; Component Type: Standard; Pin Count: 2; Value: 10uF; Status: Not Recommended; Manufacturer Part Number: GRM21BR6YA106KE43; Case: 0805; Mounted: Yes; Socket: No; SMD: Yes; Sense: No; ComponentHeight: 1.45mm; HelpURL: \\cern.ch\dfs\Applications\Altium\Datasheets\CC0805_MURATA_GRM21BR6YA106KE43L.pdf; Author: CERN DEM BC; CreateDate: 3/24/2020; LatestRevisionDate: 3/24/2020
C97 = CC0805_22UF_25V_20%_X5R_MURATA_GRM21BR61E226ME44: Non-polarised capacitor; Part Description: Chip Multilayer Ceramic Capacitor for General Purpose; Manufacturer: MURATA; Voltage: 25V; TC: X5R; Tolerance: ±20%; Part Number: CC0805_22UF_25V_20%_X5R_MURATA_GRM21BR61E226ME44; Component Kind: Standard; Component Type: Standard; Pin Count: 2; Value: 22uF; Status: Not Recommended; Manufacturer Part Number: GRM21BR61E226ME44; Case: 0805; Mounted: Yes; Socket: No; SMD: Yes; Sense: No; ComponentHeight: 1.45mm; HelpURL: \\cern.ch\dfs\Applications\Altium\Datasheets\CC0805_MURATA_GRM21BR61E226ME44.pdf; Author: CERN DEM BC; CreateDate: 10/6/2020; LatestRevisionDate: 10/6/2020
IC21 = AP62201WU-7: 4.2V TO 18V INPUT, 2A LOW IQ SYNCHRONOUS BUCK CONVERTER; Manufacturer: DIODES INCORPORATED; PressFit: No; Bonding: No; Part Number: AP62201WU-7; Component Kind: Standard; Component Type: Standard; Device: AP62201WU-7; Footprint: SOT95P280X100-6N; PackageDescription: SOT23, 0.95mm Pitch; 6 Pin, 1.625mm W X 2.90mm L X 1.00mm H body, IPC Medium Density; Part Description: 4.2V To 18V Input, 2A Low Iq Synchronous Buck Converter; Manufacturer Part Number: AP62201WU; Pin Count: 6; Case: SOT23-6; Mounted: Yes; Socket: No; SMD: Yes; Sense: No; ComponentHeight: 1.1mm; HelpURL: \\cern.ch\dfs\Applications\Altium\Datasheets\AP6220x.pdf; Author: CERN DEM HF; CreateDate: 1/7/2022; LatestRevisionDate: 3/21/2022
L2 = IND_3.3UH_20%_COILCRAFT_XAL4030: Inductor With Core; Part Description: SMD Shielded Power Inductor; Manufacturer Part Number: XAL4030-332ME; Power: 5A; Resistance: 0.026R; Tolerance: ±20%; Part Number: IND_3.3UH_20%_COILCRAFT_XAL4030; Component Kind: Standard; Component Type: Standard; Pin Count: 2; Value: 3.3uH; Manufacturer: COILCRAFT; Mounted: Yes; Socket: No; SMD: Yes; Sense: No; ComponentHeight: 3.1mm; HelpURL: \\cern.ch\dfs\Applications\Altium\Datasheets\IND_COILCRAFT_XAL4030.pdf; Author: CERN DEM BC; CreateDate: 8/7/2019; LatestRevisionDate: 8/7/2019
R37 = R0402_31K6_0.1%_0.063W_25PPM_YAGEO_RT: Resistor - 0.1%; Part Description: Thin Film Chip Resistor; Manufacturer: YAGEO; Manufacturer Part Number: RT0402BRD0731K6L; Power: 0.063W; TC: ±25ppm/°C; Voltage: 50V; PressFit: No; Part Number: R0402_31K6_0.1%_0.063W_25PPM_YAGEO_RT; Component Kind: Standard; Component Type: Standard; Pin Count: 2; Value: 31k6; Status: Not Recommended; Case: 0402; Mounted: Yes; Sense: No; Socket: No; SMD: Yes; ComponentHeight: 0.35mm; HelpURL: \\cern.ch\dfs\Applications\Altium\Datasheets\R0402_YAGEO_RT.pdf; Author: CERN DEM BC; CreateDate: 7/30/2020; LatestRevisionDate: 7/30/2020
R38 = R0402_10K_0.1%_0.063W_25PPM: Resistor - 0.1%; Part Description: Thin Film Precision Resistor; Manufacturer: GENERIC; Manufacturer1 Part Number: CPF0402B10KE1; Power: 0.063W; TC: ±25ppm/°C; PressFit: No; Part Number: R0402_10K_0.1%_0.063W_25PPM; Component Kind: Standard; Component Type: Standard; Pin Count: 2; Value: 10k; Status: Not Recommended; Manufacturer Part Number: R0402_10K_0.1%_0.063W_25PPM; Case: 0402; Mounted: Yes; Sense: No; Socket: No; SMD: Yes; Manufacturer1 Example: TE CONNECTIVITY; Manufacturer1 ComponentHeight: 0.35mm; HelpURL: \\cern.ch\dfs\Applications\Altium\Datasheets\R0402_TYCO_CPF.pdf; Author: CERN DEM JMW; CreateDate: 9/22/2015; LatestRevisionDate: 9/22/2015
R47#2 R48#2 R49#2 R50 = R0402_10K_1%_0.0625W_100PPM: Resistor - 1%; Part Description: General Purpose Thick Film Chip Resistor; Manufacturer: GENERIC; Manufacturer1 Part Number: 232270671003L; TC: ±100ppm/°C; PressFit: No; Part Number: R0402_10K_1%_0.0625W_100PPM; Component Kind: Standard; Component Type: Standard; Pin Count: 2; Value: 10k; Status: Not Recommended; Power: 0.0625W; Manufacturer Part Number: R0402_10K_1%_0.0625W_100PPM; Case: 0402; Mounted: Yes; Sense: No; Socket: No; SMD: Yes; Manufacturer1 Example: YAGEO PHYCOMP; Manufacturer1 ComponentHeight: 0.4mm; HelpURL: \\cern.ch\dfs\Applications\Altium\Datasheets\R0402_Phycomp_RC0402.pdf; Author: CERN DEM JLC; CreateDate: 12/3/2007; LatestRevisionDate: 10/17/2012

## Sheet mcu.SchDoc: FastIC+ readout
size 420 x 297 mm; CheckedBy: Jerome A. Alozy; CompanyName: CERN; DrawnBy: Vojtech Vosahlo; Organization: CERN; Address1: European Organization for Nuclear Research; Address2: CH-1211 Genève 23 - Switzerland; SheetNumber: 6; SheetTotal: 6; Projet: Fast Timing; DivGrp: EP-ESE; Designer: Vojtech Vosahlo; ModifiedDate: -
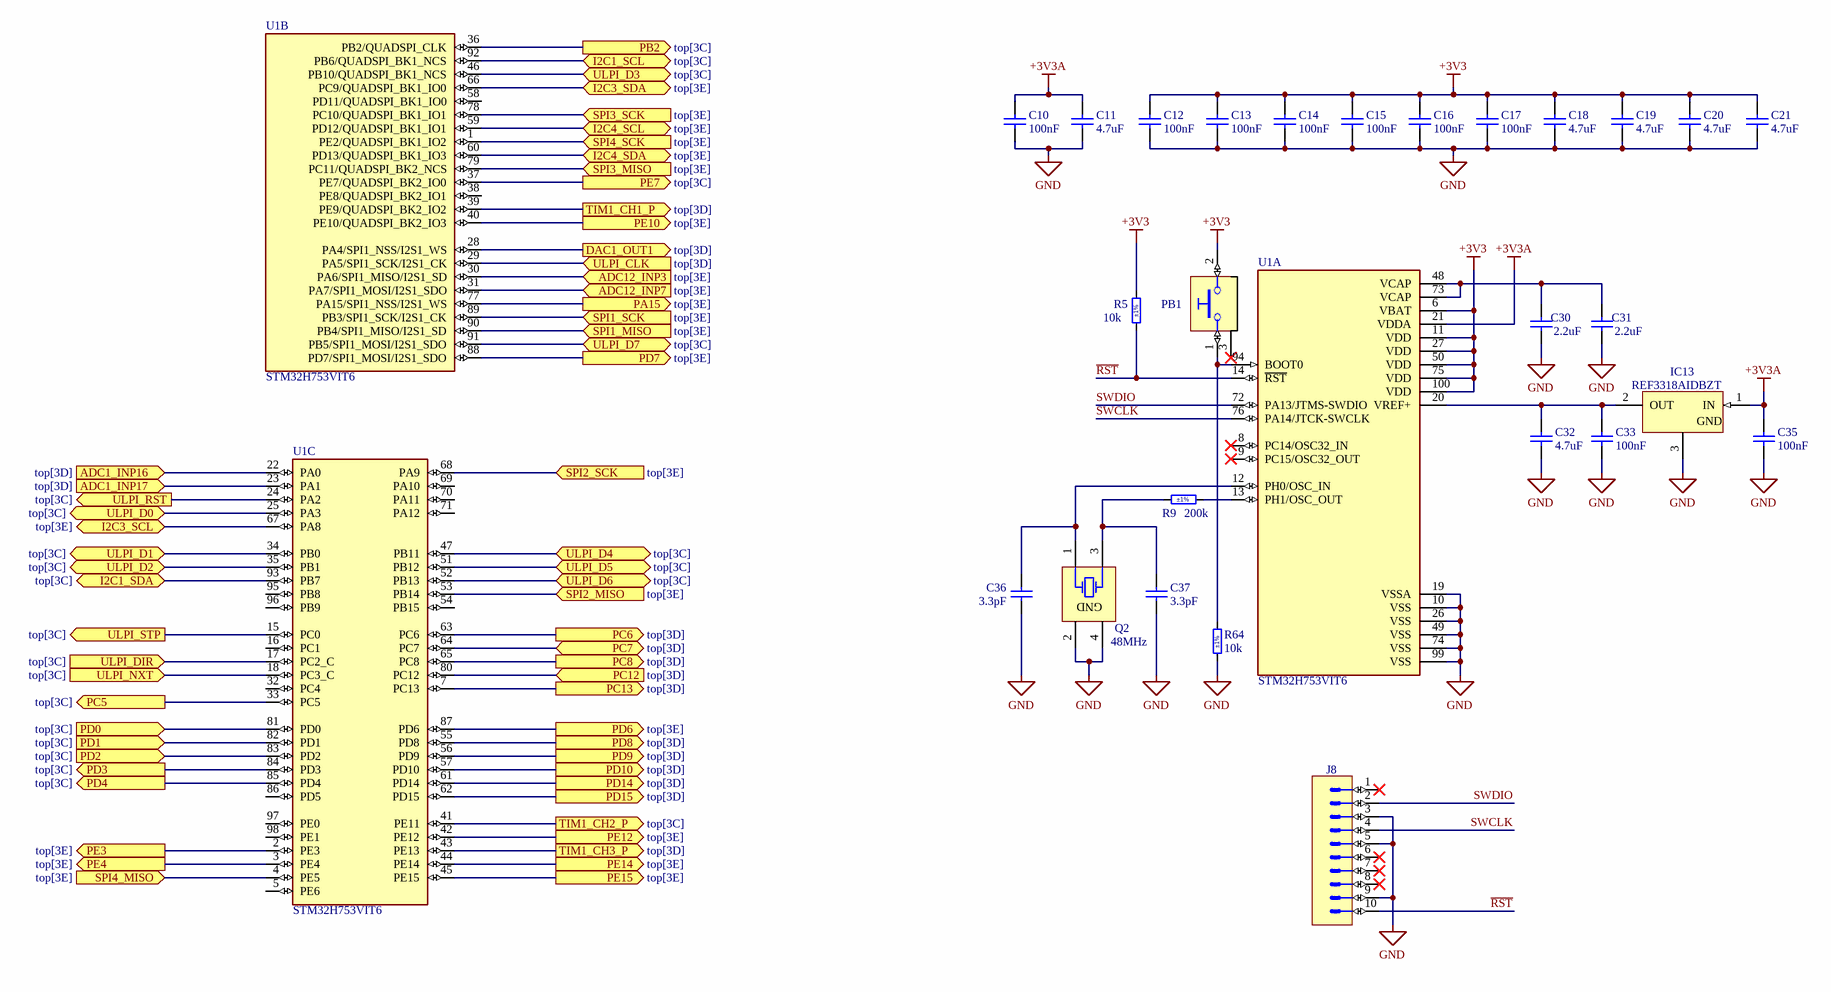
[diagram p5: mcu.SchDoc]

### Parts
(Parts that share a designator on the sheet are numbered #1, #2 ... from top to bottom, then left to right.)
C10  100nF  [CAPC1005X55N]
C11  4.7uF  [CAPC1608X87N]
C12  100nF  [CAPC1005X55N]
C13  100nF  [CAPC1005X55N]
C14  100nF  [CAPC1005X55N]
C15  100nF  [CAPC1005X55N]
C16  100nF  [CAPC1005X55N]
C17  100nF  [CAPC1005X55N]
C18  4.7uF  [CAPC1608X87N]
C19  4.7uF  [CAPC1608X87N]
C20  4.7uF  [CAPC1608X87N]
C21  4.7uF  [CAPC1608X87N]
C30#2  2.2uF  [CAPC1608X90N]
C31#2  2.2uF  [CAPC1608X90N]
C32#2  4.7uF  [CAPC1608X87N]
C33#2  100nF  [CAPC1005X55N]
C35  100nF  [CAPC1005X55N]
C36  3.3pF  [CAPC1005X55N]
C37  3.3pF  [CAPC1005X55N]
IC13#1  REF3318AIDBZT  [SOT95P237X112-3N]
J8  Header 10  [SAMTEC_FTSH-105-01-L-DV-K]  (value not drawn)
PB1  Push Button  [PB_OMRON_B3U-1100P]  (value not drawn)
Q2  48MHz  [XTAL_KYOCERA_CX3225SB]
R5#2  10k  Tolerance: ±1%  [RESC1005X40N]
R9#2  200k  Tolerance: ±1%  [RESC1005X40N]
R64  10k  Tolerance: ±1%  [RESC1005X40N]
U1  STM32H753VIT6  [QFP50P1600X1600X160-100N]  (parts A,B,C of 3)

### Ports
ADC1_INP16 (in, see top[3D]), ADC1_INP17 (in, see top[3D]), ADC12_INP3 (in, see top[3E]), ADC12_INP7 (in, see top[3E]), DAC1_OUT1 (out, see top[3D]), I2C1_SCL (bidir, see top[3C]), I2C1_SDA (bidir, see top[3C]), I2C3_SCL (bidir, see top[3E]), I2C3_SDA (bidir, see top[3E]), I2C4_SCL (bidir, see top[3E]), I2C4_SDA (bidir, see top[3E]), PA15 (out, see top[3E]), PB2 (out, see top[3C]), PC5 (out, see top[3C]), PC6 (out, see top[3D]), PC7 (bidir, see top[3D]), PC8 (out, see top[3D]), PC12 (in, see top[3D]), PC13 (out, see top[3D]), PD0 (in, see top[3C]), PD1 (in, see top[3C]), PD2 (in, see top[3C]), PD3 (out, see top[3C]), PD4 (out, see top[3C]), PD6 (out, see top[3E]), PD7 (out, see top[3E]), PD8 (out, see top[3D]), PD9 (out, see top[3D]), PD10 (out, see top[3D]), PD14 (out, see top[3D]), PD15 (out, see top[3D]), PE3 (out, see top[3E]), PE4 (out, see top[3E]), PE7 (out, see top[3C]), PE10 (out, see top[3E]), PE12 (out, see top[3E]), PE14 (out, see top[3E]), PE15 (out, see top[3E]), SPI1_MISO (in, see top[3E]), SPI1_SCK (in, see top[3E]), SPI2_MISO (in, see top[3E]), SPI2_SCK (in, see top[3E]), SPI3_MISO (in, see top[3E]), SPI3_SCK (in, see top[3E]), SPI4_MISO (in, see top[3E]), SPI4_SCK (in, see top[3E]), TIM1_CH1_P (out, see top[3D]), TIM1_CH2_P (out, see top[3C]), TIM1_CH3_P (out, see top[3D]), ULPI_CLK (in, see top[3D]), ULPI_D0 (bidir, see top[3C]), ULPI_D1 (bidir, see top[3C]), ULPI_D2 (bidir, see top[3C]), ULPI_D3 (bidir, see top[3C]), ULPI_D4 (bidir, see top[3C]), ULPI_D5 (bidir, see top[3C]), ULPI_D6 (bidir, see top[3C]), ULPI_D7 (bidir, see top[3C]), ULPI_DIR (in, see top[3C]), ULPI_NXT (in, see top[3C]), ULPI_RST (out, see top[3C]), ULPI_STP (out, see top[3C])

### Nets
+3V3: C12.1 C13.1 C14.1 C15.1 C16.1 C17.1 C18.1 C19.1 C20.1 C21.1 PB1.2 R5#2.2 U1.6(VBAT) U1.11(VDD) U1.27(VDD) U1.50(VDD) U1.75(VDD) U1.100(VDD)
+3V3A: C10.1 C11.1 C35.1 IC13#1.1(IN) U1.21(VDDA)
GND: C10.2 C11.2 C12.2 C13.2 C14.2 C15.2 C16.2 C17.2 C18.2 C19.2 C20.2 C21.2 C30#2.1 C31#2.1 C32#2.2 C33#2.2 C35.2 C36.1 C37.1 IC13#1.3(GND) J8.3 J8.5 J8.9 Q2.2(GND) Q2.4(GND) R64.1 U1.10(VSS) U1.19(VSSA) U1.26(VSS) U1.49(VSS) U1.74(VSS) U1.99(VSS)
~{RST}: J8.10 R5#2.1 U1.14(~{RST})
SWCLK: J8.4 U1.76(PA14/JTCK-SWCLK)
SWDIO: J8.2 U1.72(PA13/JTMS-SWDIO)
NetC30#2_2: C30#2.2 C31#2.2 U1.48(VCAP) U1.73(VCAP)
NetC32#2_1: C32#2.1 C33#2.1 IC13#1.2(OUT) U1.20(VREF+)
NetC36_2: C36.2 Q2.1(X) U1.12(PH0/OSC_IN)
NetC37_2: C37.2 Q2.3(X) R9#2.1
NetIC4_5: U1.56(PD9) ; port PD9
NetIC14_6: U1.92(PB6/QUADSPI_BK1_NCS) ; port I2C1_SCL
NetIC14_7: U1.93(PB7) ; port I2C1_SDA
NetPB1_1: PB1.1 R64.2 U1.94(BOOT0)
NetR7_2: U1.68(PA9) ; port SPI2_SCK
NetR8_2: U1.1(PE2/QUADSPI_BK1_IO2) ; port SPI4_SCK
NetR9#2_2: R9#2.2 U1.13(PH1/OSC_OUT)
NetR17_2: U1.77(PA15/SPI1_NSS/I2S1_WS) ; port PA15
NetU1_2: U1.2(PE3) ; port PE3
NetU1_3: U1.3(PE4) ; port PE4
NetU1_4: U1.4(PE5) ; port SPI4_MISO
NetU1_7: U1.7(PC13) ; port PC13
NetU1_15: U1.15(PC0) ; port ULPI_STP
NetU1_17: U1.17(PC2_C) ; port ULPI_DIR
NetU1_18: U1.18(PC3_C) ; port ULPI_NXT
NetU1_22: U1.22(PA0) ; port ADC1_INP16
NetU1_23: U1.23(PA1) ; port ADC1_INP17
NetU1_24: U1.24(PA2) ; port ULPI_RST
NetU1_25: U1.25(PA3) ; port ULPI_D0
NetU1_28: U1.28(PA4/SPI1_NSS/I2S1_WS) ; port DAC1_OUT1
NetU1_29: U1.29(PA5/SPI1_SCK/I2S1_CK) ; port ULPI_CLK
NetU1_30: U1.30(PA6/SPI1_MISO/I2S1_SD) ; port ADC12_INP3
NetU1_31: U1.31(PA7/SPI1_MOSI/I2S1_SDO) ; port ADC12_INP7
NetU1_33: U1.33(PC5) ; port PC5
NetU1_34: U1.34(PB0) ; port ULPI_D1
NetU1_35: U1.35(PB1) ; port ULPI_D2
NetU1_36: U1.36(PB2/QUADSPI_CLK) ; port PB2
NetU1_37: U1.37(PE7/QUADSPI_BK2_IO0) ; port PE7
NetU1_39: U1.39(PE9/QUADSPI_BK2_IO2) ; port TIM1_CH1_P
NetU1_40: U1.40(PE10/QUADSPI_BK2_IO3) ; port PE10
NetU1_41: U1.41(PE11) ; port TIM1_CH2_P
NetU1_42: U1.42(PE12) ; port PE12
NetU1_43: U1.43(PE13) ; port TIM1_CH3_P
NetU1_44: U1.44(PE14) ; port PE14
NetU1_45: U1.45(PE15) ; port PE15
NetU1_46: U1.46(PB10/QUADSPI_BK1_NCS) ; port ULPI_D3
NetU1_47: U1.47(PB11) ; port ULPI_D4
NetU1_51: U1.51(PB12) ; port ULPI_D5
NetU1_52: U1.52(PB13) ; port ULPI_D6
NetU1_53: U1.53(PB14) ; port SPI2_MISO
NetU1_55: U1.55(PD8) ; port PD8
NetU1_57: U1.57(PD10) ; port PD10
NetU1_59: U1.59(PD12/QUADSPI_BK1_IO1) ; port I2C4_SCL
NetU1_60: U1.60(PD13/QUADSPI_BK1_IO3) ; port I2C4_SDA
NetU1_61: U1.61(PD14) ; port PD14
NetU1_62: U1.62(PD15) ; port PD15
NetU1_63: U1.63(PC6) ; port PC6
NetU1_64: U1.64(PC7) ; port PC7
NetU1_65: U1.65(PC8) ; port PC8
NetU1_66: U1.66(PC9/QUADSPI_BK1_IO0) ; port I2C3_SDA
NetU1_67: U1.67(PA8) ; port I2C3_SCL
NetU1_78: U1.78(PC10/QUADSPI_BK1_IO1) ; port SPI3_SCK
NetU1_79: U1.79(PC11/QUADSPI_BK2_NCS) ; port SPI3_MISO
NetU1_80: U1.80(PC12) ; port PC12
NetU1_81: U1.81(PD0) ; port PD0
NetU1_82: U1.82(PD1) ; port PD1
NetU1_83: U1.83(PD2) ; port PD2
NetU1_84: U1.84(PD3) ; port PD3
NetU1_85: U1.85(PD4) ; port PD4
NetU1_87: U1.87(PD6) ; port PD6
NetU1_88: U1.88(PD7/SPI1_MOSI/I2S1_SDO) ; port PD7
NetU1_89: U1.89(PB3/SPI1_SCK/I2S1_CK) ; port SPI1_SCK
NetU1_90: U1.90(PB4/SPI1_MISO/I2S1_SD) ; port SPI1_MISO
NetU1_91: U1.91(PB5/SPI1_MOSI/I2S1_SDO) ; port ULPI_D7

Not connected (* = marked no-connect by the designer): J8 1* 6* 7* 8*; PB1 3*; U1 5(PE6) 8(PC14/OSC32_IN)* 9(PC15/OSC32_OUT)* 16(PC1) 32(PC4) 38(PE8/QUADSPI_BK2_IO1) 54(PB15) 58(PD11/QUADSPI_BK1_IO0) 69(PA10) 70(PA11) 71(PA12) 86(PD5) 95(PB8) 96(PB9) 97(PE0) 98(PE1)

### Notes on the sheet
- Project/Equipment
- Document
- Designer
- Drawn by
- Check.by
- File
- Last Mod.
- Print Date
- Sheet
- Size
- A3
- of
- Rev

### Library data of the parts
C10 C12-C17 C33#2 C35 = CC0402_100NF_16V_10%_X7R: as C139 on sheet hv; Part Number: CC0402_100NF_16V_10%_X7R; Component Kind: Standard; Component Type: Standard; Pin Count: 2; Value: 100nF; Status: Not Recommended; Manufacturer Part Number: CC0402_100NF_16V_10%_X7R; Case: 0402; Mounted: Yes; Socket: No; SMD: Yes; Sense: No; HelpURL: \\cern.ch\dfs\Applications\Altium\Datasheets\CC0402_X7R_MURATA_GRM.pdf; Author: CERN DEM JLC; CreateDate: 05/12/2013; LatestRevisionDate: 03/12/2007; Manufacturer1 Example: MURATA; Manufacturer1 ComponentHeight: 0.55mm
C11 C18-C21 C32#2 = CC0603_4.7UF_6.3V_10%_X5R: as C34#1 on sheet clock; Part Number: CC0603_4.7UF_6.3V_10%_X5R; Component Kind: Standard; Component Type: Standard; Pin Count: 2; Value: 4.7uF; Status: Preferred; Manufacturer Part Number: CC0603_4.7UF_6.3V_10%_X5R; Case: 0603; Mounted: Yes; Socket: No; SMD: Yes; Sense: No; Manufacturer1 Example: PHYCOMP; Manufacturer1 ComponentHeight: 0.87mm; HelpURL: \\cern.ch\dfs\Applications\Altium\Datasheets\CC0805_X5R_PHYCOMP_HC.pdf; Author: CERN DEM JLC; CreateDate: 03/12/2007; LatestRevisionDate: 03/12/2007
C30#2 C31#2 = CC0603_2.2UF_10V_20%_X7R: as C25 on sheet power; Part Number: CC0603_2.2UF_10V_20%_X7R; Component Kind: Standard; Component Type: Standard; Pin Count: 2; Value: 2.2uF; Status: Not Recommended; Manufacturer Part Number: CC0603_2.2UF_10V_20%_X7R; Case: 0603; Mounted: Yes; Socket: No; SMD: Yes; Sense: No; Manufacturer1 Example: TAIYO YUDEN; Manufacturer1 ComponentHeight: 0.9mm; HelpURL: \\cern.ch\dfs\Applications\Altium\Datasheets\CC0603_X7R_TAIYO-YUDEN_HIGH-VALUE.pdf; Author: CERN DEM JLC; CreateDate: 6/22/2011; LatestRevisionDate: 6/27/2011
C36 C37 = CC0402_3.3PF_50V_0.25PF_C0G: Non-polarised capacitor; Part Description: SMD Multilayer Chip Ceramic Capacitor; Manufacturer: GENERIC; Manufacturer1 Part Number: C0402C339C5GACTU; Voltage: 50V; TC: C0G/NP0; Tolerance: ±0.25pF; Part Number: CC0402_3.3PF_50V_0.25PF_C0G; Component Kind: Standard; Component Type: Standard; Pin Count: 2; Value: 3.3pF; Status: Preferred; Manufacturer Part Number: CC0402_3.3PF_50V_0.25PF_C0G; Case: 0402; Mounted: Yes; Socket: No; SMD: Yes; Sense: No; Manufacturer1 Example: KEMET; Manufacturer1 ComponentHeight: 0.55mm; HelpURL: \\cern.ch\dfs\Applications\Altium\Datasheets\CC0402_C0G_KEMET_(Commercial Grade).pdf; Author: CERN DEM JLC; CreateDate: 12/3/2007; LatestRevisionDate: 4/22/2015
IC13#1 = REF3318AIDBZT: 3-Terminal Regulator 1=IN 2=OUT 3=GND; Part Description: 1.8V, 30ppm/°C Drift, 3.9uA, Voltage Reference; Manufacturer: TEXAS INSTRUMENTS; PressFit: No; Bonding: No; Part Number: REF3318AIDBZT; Component Kind: Standard; Component Type: Standard; Device: REF3318AIDBZT; PackageDescription: SOT, 0.95mm Pitch; 3 Pin, 1.30mm W X 2.92mm L X 1.12mm H body, IPC Medium Density; Manufacturer Part Number: REF3318AIDBZT; Pin Count: 3; Case: SOT23-3; Mounted: Yes; Socket: No; SMD: Yes; Sense: No; ComponentHeight: 1.12mm; HelpURL: \\cern.ch\dfs\Applications\Altium\Datasheets\REF3318AIDBZT.pdf; Author: CERN DEM JLC; CreateDate: 6/20/2011; LatestRevisionDate: 6/20/2011
J8 = SAMTEC_FTSH-105-01-L-DV-K: Connector 10 Male; Part Description: 10 Contacts, Pitch 1.27mm, Dual Row Straight Shrouded SMT Micro Header with Keying Shroud; Manufacturer: SAMTEC; PressFit: No; Part Number: SAMTEC_FTSH-105-01-L-DV-K; Component Kind: Standard; Component Type: Standard; Pin Count: 10; Family: Header 10; Mounted: Yes; Socket: No; SMD: Yes; Sense: No; Status: None; Manufacturer Part Number: FTSH-105-01-L-DV-K; ComponentHeight: 6.25mm; HelpURL: \\cern.ch\dfs\Applications\Altium\Datasheets\SAMTEC_FTSH-105-01-L-DV-K.pdf; Author: CERN DEM BC; CreateDate: 1/17/2020; LatestRevisionDate: 1/17/2020
PB1 = PB_OMRON_B3U-1100P: Push-Button Switch SPST; Part Description: 3x2.5mm Ultra-Small Tactile SPST Pushbutton Switch (with Ground Terminal),Contact Rating 50mA 12VDC, B3U Series; Manufacturer: OMRON; PressFit: No; Part Number: PB_OMRON_B3U-1100P; Component Kind: Standard; Component Type: Standard; Pin Count: 3; PackageDescription: Body 1.2x3x2.5mm Ultra-Small Tactile SPST Pushbutton Switch, (with Ground Terminal), OMRON B3U Series; Family: Push Button; Mounted: Yes; Socket: No; SMD: Yes; Sense: No; Status: None; Manufacturer Part Number: B3U-1100P; ComponentHeight: 1.75mm; HelpURL: \\cern.ch\dfs\Applications\Altium\Datasheets\PB_OMRON_B3U-1100P.pdf; Author: CERN DEM JLC; CreateDate: 3/16/2010; LatestRevisionDate: 6/16/2022
Q2 = XTAL_48MHZ_KYOCERA_CX3225SB48000D0FPJC1: as Q1 on sheet clock; Part Number: XTAL_48MHZ_KYOCERA_CX3225SB48000D0FPJC1; Component Kind: Standard; Component Type: Standard; PackageDescription: SMD Crystal Kyocera, 4 Pins, 2.50mm L X 3.20mm W X 0.6mm H; Value: 48MHz; Manufacturer: KYOCERA; Manufacturer Part Number: CX3225SB48000D0FPJC1; Pin Count: 4; Mounted: Yes; Socket: No; SMD: Yes; Sense: No; ComponentHeight: 0.6mm; HelpURL: \\cern.ch\dfs\Applications\Altium\Datasheets\XTAL_KYOCERA_CX3225SB.pdf; Author: CERN DEM JLC; CreateDate: 6/5/2018; LatestRevisionDate: 6/5/2018
R5#2 R64 = R0402_10K_1%_0.0625W_100PPM: as R47#2 on sheet power; Part Number: R0402_10K_1%_0.0625W_100PPM; Component Kind: Standard; Component Type: Standard; Pin Count: 2; Value: 10k; Status: Not Recommended; Power: 0.0625W; Manufacturer Part Number: R0402_10K_1%_0.0625W_100PPM; Case: 0402; Mounted: Yes; Sense: No; Socket: No; SMD: Yes; Manufacturer1 Example: YAGEO PHYCOMP; Manufacturer1 ComponentHeight: 0.4mm; HelpURL: \\cern.ch\dfs\Applications\Altium\Datasheets\R0402_Phycomp_RC0402.pdf; Author: CERN DEM JLC; CreateDate: 12/3/2007; LatestRevisionDate: 10/17/2012
R9#2 = R0402_200K_1%_0.0625W_100PPM: as R55 on sheet hv; Part Number: R0402_200K_1%_0.0625W_100PPM; Component Kind: Standard; Component Type: Standard; Pin Count: 2; Value: 200k; Status: Not Recommended; Power: 0.0625W; Manufacturer Part Number: R0402_200K_1%_0.0625W_100PPM; Case: 0402; Mounted: Yes; Sense: No; Socket: No; SMD: Yes; Manufacturer1 Example: YAGEO PHYCOMP; Manufacturer1 ComponentHeight: 0.4mm; HelpURL: \\cern.ch\dfs\Applications\Altium\Datasheets\R0402_Phycomp_RC0402.pdf; Author: CERN DEM JLC; CreateDate: 12/3/2007; LatestRevisionDate: 10/17/2012
U1 = STM32H753VIT6: ARMÂ® CortexÂ®-M7 STM32H7 Microcontroller IC 32-Bit 480MHz 2MB _2M x 8_ FLASH 100-LQFP _14x14_; MF: STMicroelectronics; MP: STM32H753VIT6; Availability: Unavailable; SnapEDA_Link: https://www.snapeda.com/parts/STM32H753VIT6/STMicroelectronics/view-part/2770314/?ref=snap; Value: *; Package: LQFP-100 STMicroelectronics; Price: None